# Altium schematic sheet Output_DLS.SchDoc
size 127 x 127 mm; SheetNumber: 2; SheetTotal: 4
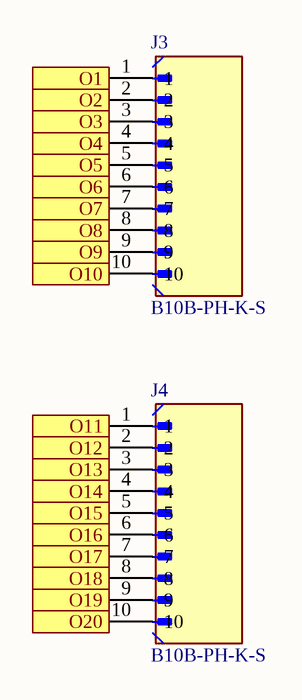
[diagram p0: Output_DLS.SchDoc]

## Parts
J3  B10B-PH-K-S  [JST_B10B-PH-K-S]
J4  B10B-PH-K-S  [JST_B10B-PH-K-S]

## Ports
O1 (in, see Main_DLS[5C]), O2 (in, see Main_DLS[5C]), O3 (in, see Main_DLS[5B]), O4 (in, see Main_DLS[5B]), O5 (in, see Main_DLS[5B]), O6 (in, see Main_DLS[5B]), O7 (in, see Main_DLS[5B]), O8 (in, see Main_DLS[5B]), O9 (in, see Main_DLS[5B]), O10 (in, see Main_DLS[5B]), O11 (in, see Main_DLS[5B]), O12 (in, see Main_DLS[5B]), O13 (in, see Main_DLS[5C]), O14 (in, see Main_DLS[5C]), O15 (in, see Main_DLS[5C]), O16 (in, see Main_DLS[5C]), O17 (in, see Main_DLS[5C]), O18 (out, see Main_DLS[5C]), O19 (out, see Main_DLS[5C]), O20 (out, see Main_DLS[5C])

## Nets
O1: J3.1 ; port O1
O2: J3.2 ; port O2
O3: J3.3 ; port O3
O4: J3.4 ; port O4
O5: J3.5 ; port O5
O6: J3.6 ; port O6
O7: J3.7 ; port O7
O8: J3.8 ; port O8
O9: J3.9 ; port O9
O10: J3.10 ; port O10
O11: J4.1 ; port O11
O12: J4.2 ; port O12
O13: J4.3 ; port O13
O14: J4.4 ; port O14
O15: J4.5 ; port O15
O16: J4.6 ; port O16
O17: J4.7 ; port O17
O18: J4.8 ; port O18
O19: J4.9 ; port O19
O20: J4.10 ; port O20

## Library data of the parts
J3 J4 = B10B-PH-K-S: 2.0 mm pitch/Disconnectable Crimp style connectors; MF: JST Sales America Inc.; SnapEDA_Link: https://www.snapeda.com/parts/B10B-PH-K-S/JST/view-part/?ref=snap; Package: None; Value: *; MP: B10B-PH-K-S; Check_prices: https://www.snapeda.com/parts/B10B-PH-K-S/JST/view-part/?ref=eda